# EAGLE design bt-lights-shield (EAGLE 6.1)
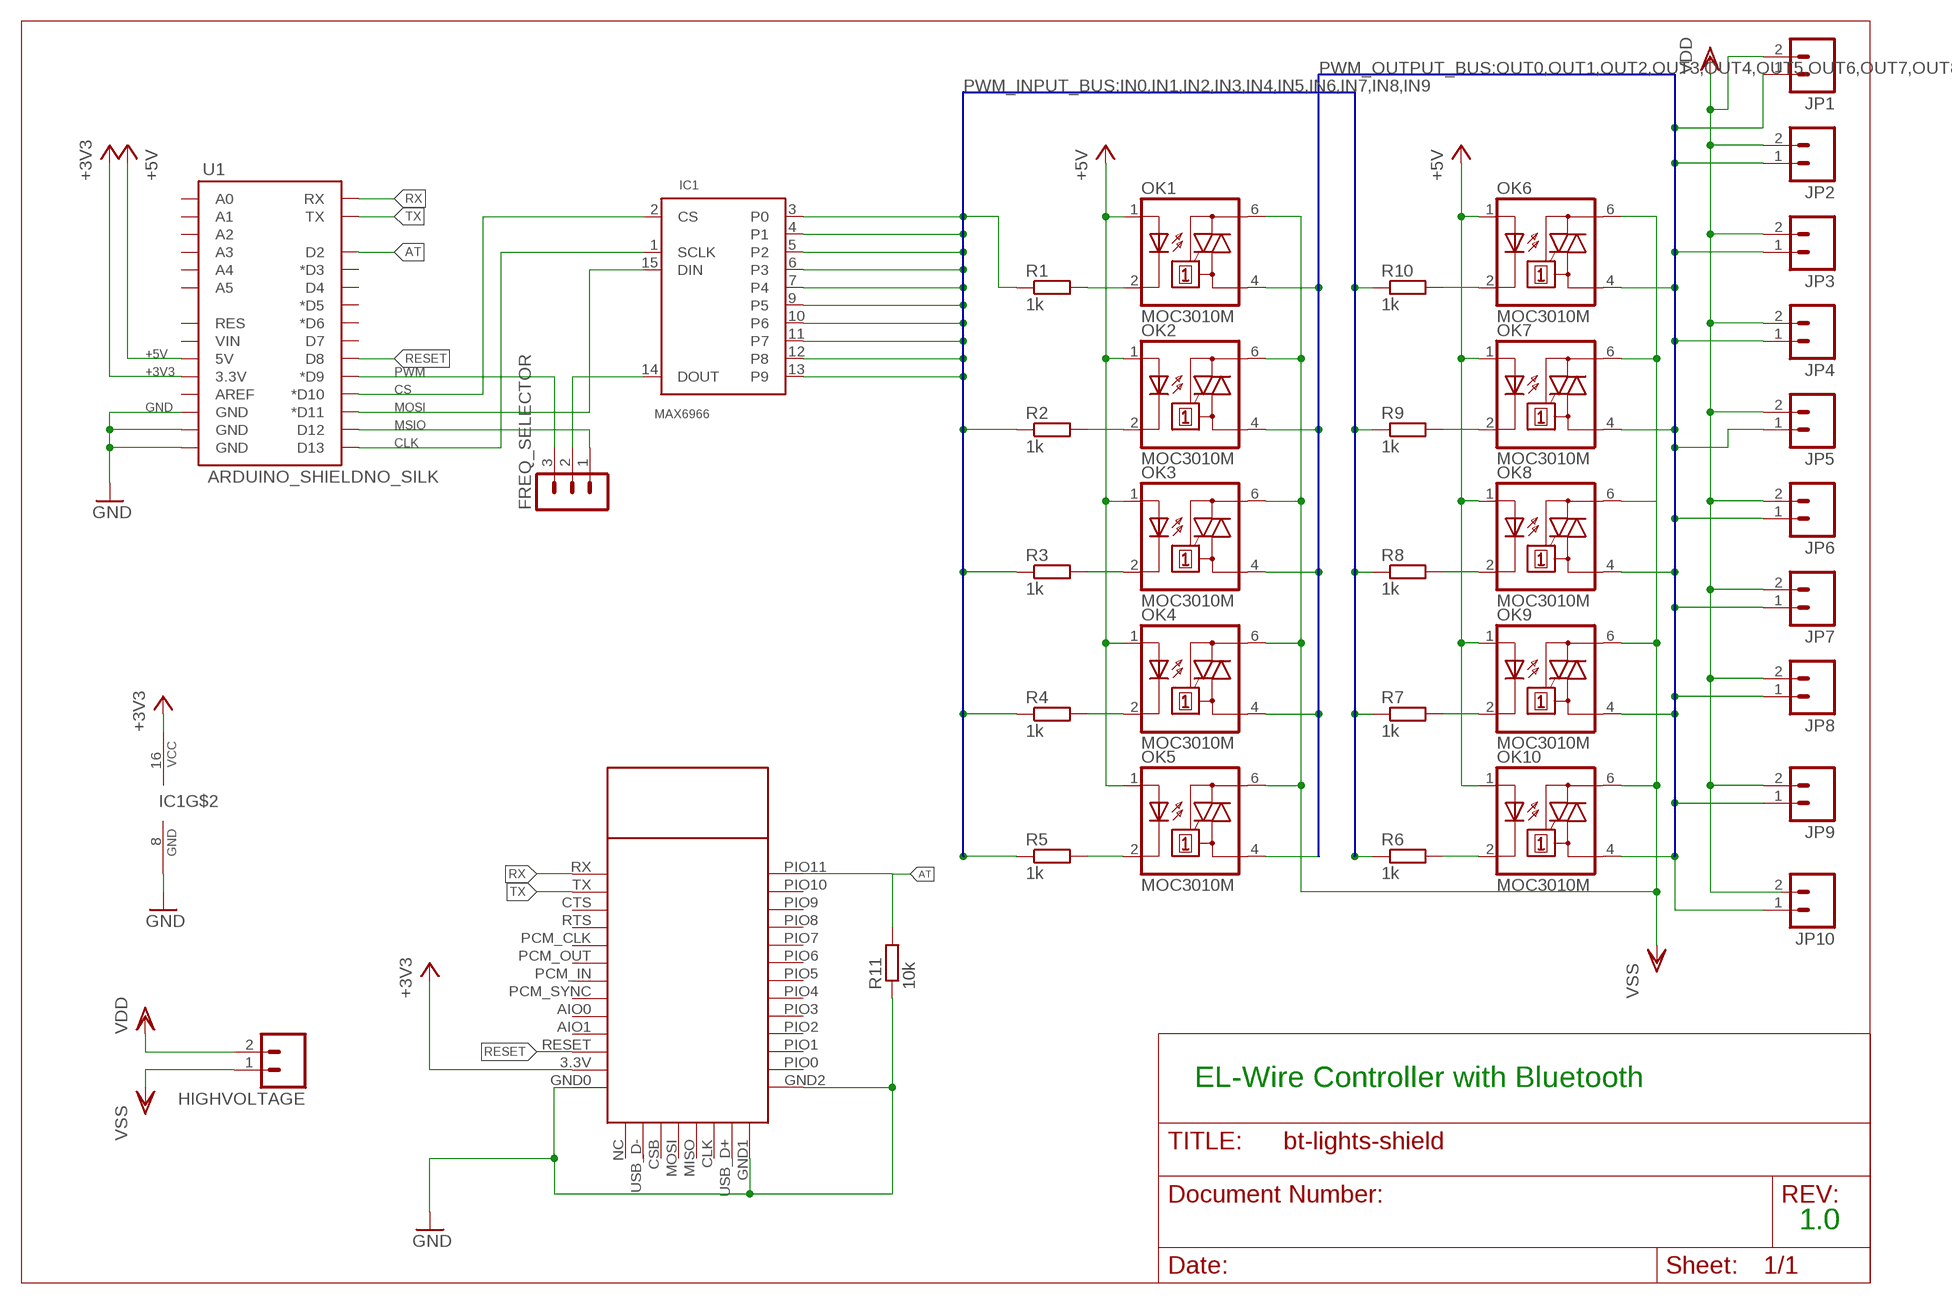
[diagram p0: schematic, sheet 1]

## Parts
FREQ_SELECTOR  MA03-1  [MA03-1]
HC0305  HC0305  [HC0305]
HIGHVOLTAGE  M02-JST-2MM-SMT  [JST-2-SMD]
IC1  MAX6966  MAX6966AEE  [QSOP16]
JP1  M02-JST-2MM-SMT  [JST-2-SMD]
JP2  M02-JST-2MM-SMT  [JST-2-SMD]
JP3  M02-JST-2MM-SMT  [JST-2-SMD]
JP4  M02-JST-2MM-SMT  [JST-2-SMD]
JP5  M02-JST-2MM-SMT  [JST-2-SMD]
JP6  M02-JST-2MM-SMT  [JST-2-SMD]
JP7  M02-JST-2MM-SMT  [JST-2-SMD]
JP8  M02-JST-2MM-SMT  [JST-2-SMD]
JP9  M02-JST-2MM-SMT  [JST-2-SMD]
JP10  M02-JST-2MM-SMT  [JST-2-SMD]
OK1  MOC3010M  [DIL06]
OK2  MOC3010M  [DIL06]
OK3  MOC3010M  [DIL06]
OK4  MOC3010M  [DIL06]
OK5  MOC3010M  [DIL06]
OK6  MOC3010M  [DIL06]
OK7  MOC3010M  [DIL06]
OK8  MOC3010M  [DIL06]
OK9  MOC3010M  [DIL06]
OK10  MOC3010M  [DIL06]
R1  1k  R-EU_R1206  [R1206]
R2  1k  R-EU_R1206  [R1206]
R3  1k  R-EU_R1206  [R1206]
R4  1k  R-EU_R1206  [R1206]
R5  1k  R-EU_R1206  [R1206]
R6  1k  R-EU_R1206  [R1206]
R7  1k  R-EU_R1206  [R1206]
R8  1k  R-EU_R1206  [R1206]
R9  1k  R-EU_R1206  [R1206]
R10  1k  R-EU_R1206  [R1206]
R11  10k  R-EU_R1206  [R1206]
U1  ARDUINO_SHIELDNO_SILK  [DUEMILANOVE_VIAS]

## Nets
+3V3: HC0305.3.3V IC1.16(VCC) U1.3.3V
+5V: OK1.1(A) OK2.1(A) OK3.1(A) OK4.1(A) OK5.1(A) OK6.1(A) OK7.1(A) OK8.1(A) OK9.1(A) OK10.1(A) U1.5V
AT: HC0305.PIO11 R11.2 U1.D2
CLK: IC1.1(SCLK) U1.D13
CS: IC1.2(CS) U1.D10(*D10)
GND: HC0305.GND0 HC0305.GND1 HC0305.GND2 IC1.8(GND) R11.1 U1.GND@0(GND) U1.GND@1(GND) U1.GND@2(GND)
IN0: IC1.3(P0) R1.1
IN1: IC1.4(P1) R2.1
IN2: IC1.5(P2) R3.1
IN3: IC1.6(P3) R4.1
IN4: IC1.7(P4) R5.1
IN5: IC1.9(P5) R10.1
IN6: IC1.10(P6) R9.1
IN7: IC1.11(P7) R8.1
IN8: IC1.12(P8) R7.1
IN9: IC1.13(P9) R6.1
MOSI: IC1.15(DIN) U1.D11(*D11)
MSIO: FREQ_SELECTOR.1 U1.D12
N$5: OK1.2(C) R1.2
N$6: OK10.2(C) R6.2
N$7: OK9.2(C) R7.2
N$8: OK8.2(C) R8.2
N$9: OK7.2(C) R9.2
N$10: OK6.2(C) R10.2
N$11: OK2.2(C) R2.2
N$12: OK3.2(C) R3.2
N$13: OK4.2(C) R4.2
N$14: OK5.2(C) R5.2
N$16: FREQ_SELECTOR.2 IC1.14(DOUT)
OUT0: JP1.1 OK1.4(A1)
OUT1: JP2.1 OK2.4(A1)
OUT2: JP3.1 OK3.4(A1)
OUT3: JP4.1 OK4.4(A1)
OUT4: JP5.1 OK5.4(A1)
OUT5: JP6.1 OK6.4(A1)
OUT6: JP7.1 OK7.4(A1)
OUT7: JP8.1 OK8.4(A1)
OUT8: JP9.1 OK9.4(A1)
OUT9: JP10.1 OK10.4(A1)
PWM: FREQ_SELECTOR.3 U1.D9(*D9)
RESET: HC0305.RESET U1.D8
RX: HC0305.RX U1.RX
TX: HC0305.TX U1.TX
VDD: HIGHVOLTAGE.2 JP1.2 JP2.2 JP3.2 JP4.2 JP5.2 JP6.2 JP7.2 JP8.2 JP9.2 JP10.2
VSS: HIGHVOLTAGE.1 OK1.6(A2) OK2.6(A2) OK3.6(A2) OK4.6(A2) OK5.6(A2) OK6.6(A2) OK7.6(A2) OK8.6(A2) OK9.6(A2) OK10.6(A2)
Unconnected: HC0305.AIO0 HC0305.AIO1 HC0305.CLK HC0305.CSB HC0305.CTS HC0305.MISO HC0305.MOSI HC0305.NC HC0305.PCM_CLK HC0305.PCM_IN HC0305.PCM_OUT HC0305.PCM_SYNC(PCM_SNYC) HC0305.PIO0 HC0305.PIO1 HC0305.PIO2 HC0305.PIO3 HC0305.PIO4 HC0305.PIO5 HC0305.PIO6 HC0305.PIO7 HC0305.PIO8 HC0305.PIO9 HC0305.PIO10 HC0305.RTS HC0305.USB_D+ HC0305.USB_D- U1.A0 U1.A1 U1.A2 U1.A3 U1.A4 U1.A5 U1.AREF U1.D3(*D3) U1.D4 U1.D5(*D5) U1.D6(*D6) U1.D7 U1.RES U1.VIN

## Buses
PWM_INPUT_BUS:IN0,IN1,IN2,IN3,IN4,IN5,IN6,IN7,IN8,IN9
PWM_OUTPUT_BUS:OUT0,OUT1,OUT2,OUT3,OUT4,OUT5,OUT6,OUT7,OUT8,OU9

## Notes on the sheet
- EL-Wire Controller with Bluetooth
- 1.0

## Library data of the parts
FREQ_SELECTOR = con-lstb:MA03-1: PIN HEADER; OC_FARNELL: unknown; OC_NEWARK: unknown
HC0305 = HC0305:HC0305
HIGHVOLTAGE JP1-JP10 = SparkFun-Connectors:M02: Header 2 Standard 2-pin 0.1" header. Use with straight break away headers (SKU : PRT-00116), right angle break away headers (PRT-00553), swiss pins (PRT-00743), machine pins (PRT-00117), and female headers (PRT-00115). Molex polarized connector foot print use with SKU : PRT-08233 with associated crimp pins and housings.; PROD_ID: CONN-08352
IC1 = max696x:MAX6966AEE
OK1-OK10 = optocoupler:MOC30*M: RANDOM-PHASE OPTOISOLATORS TRIAC DRIVER OUTPUT Source: http://www.fairchildsemi.com MOC3020-M.pdf; MF: FAIRCHILD SEMICONDUCTOR; MPN: MOC3010-M; OC_FARNELL: 1505423; OC_NEWARK: 72K8892
R1-R11 = resistor:R-EU_: RESISTOR, European symbol
U1 = SparkFun-Boards:ARDUINO_SHIELD: Arduino shield footprint

## Board
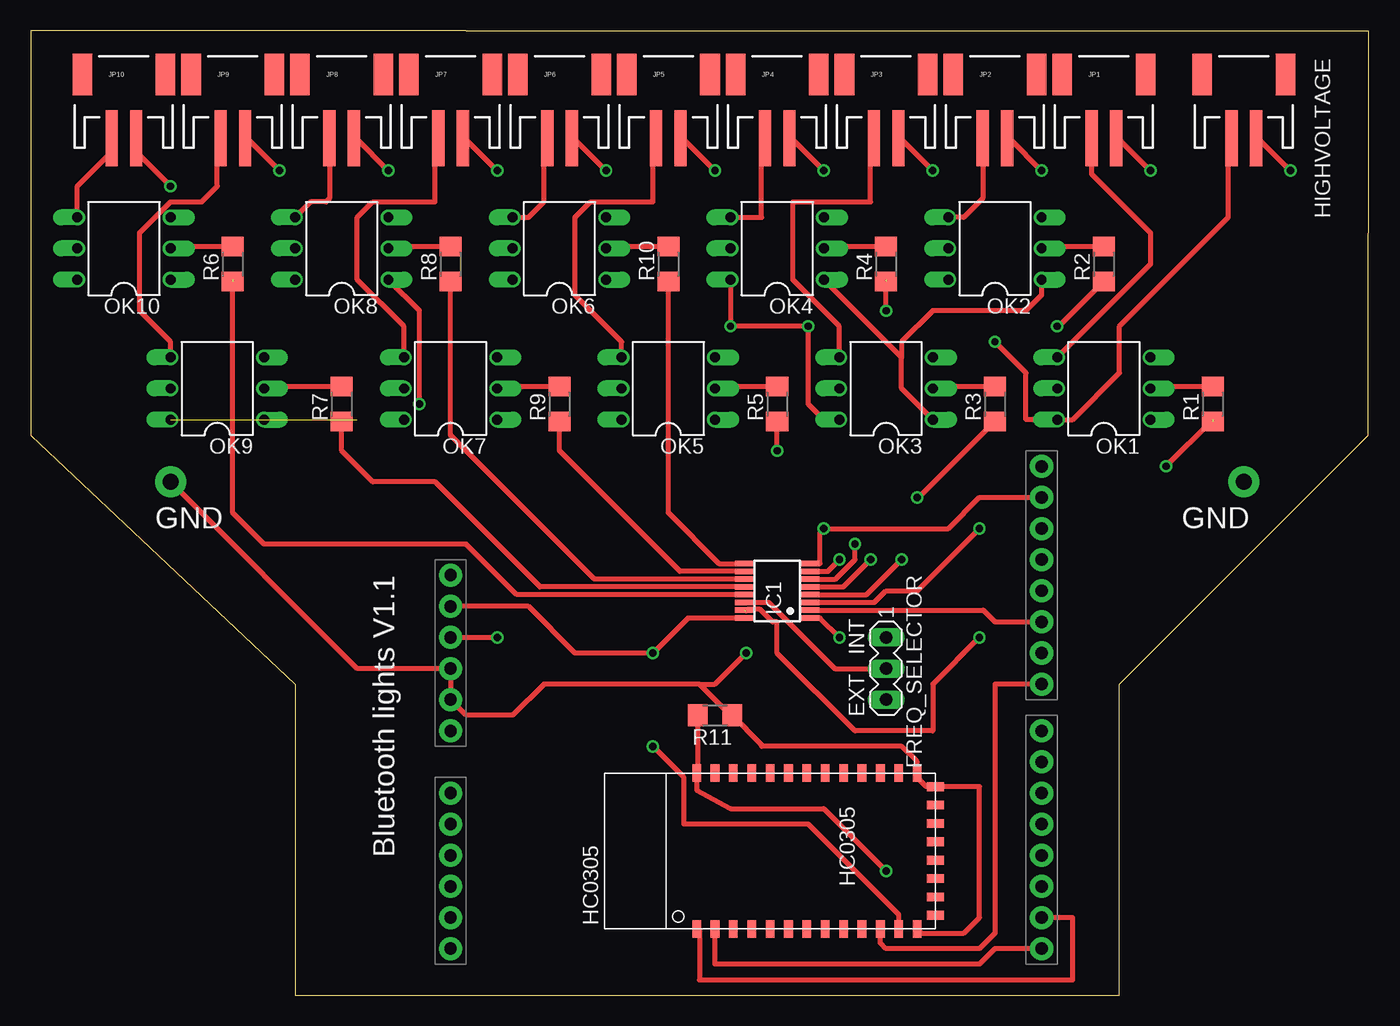
[diagram p1: board, top side]
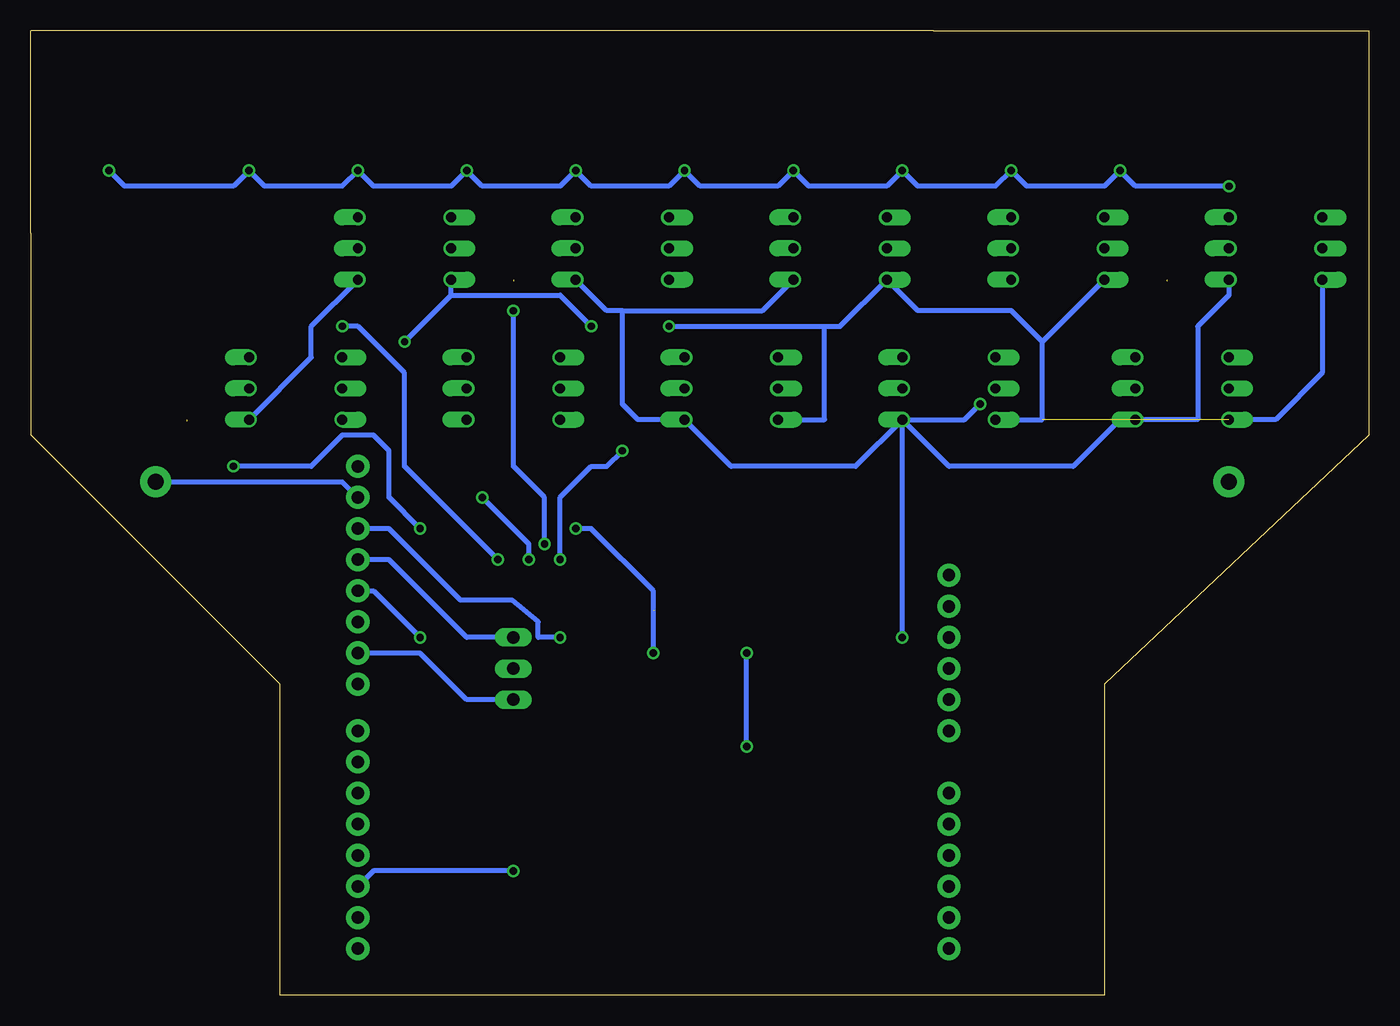
[diagram p2: board, bottom side, seen from below]

Size 109.27 x 78.74 mm. Coordinates in mm from the lower left corner, seen from the top.
Outline: 109.27,78.73 109.22,45.72 88.9,25.4 88.9,0 21.59,0 21.59,25.4 0,45.72 0,78.74 35.56,78.73
Outline: 35.56,78.74 109.22,78.74
Copper layers (1*16): Top 0.035mm / dielectric 1.5mm / Bottom 0.035mm
Design rules: minimum track width 10mil, minimum drill 24mil, track to track 8mil, track to pad 8mil, pad to pad 8mil, via to via 8mil, smd to smd 8mil, copper to edge 40mil, drill to drill 8mil, minimum pad ring 10mil, minimum via ring 8mil, stop-mask expansion 4mil, vias tented up to drill 0mil, thermal gap 10mil

### Footprints (pad centres in the part's own frame; a part is rotated, then mirrored left to right if it is on the bottom)
MA03-1 = drill 1.016 long: 1 -2.54,0; 2 0,0; 3 2.54,0
HC0305 = smd 1.422 x 0.711: 3.3V -6,-15; AIO0 -6,-10.5; AIO1 -6,-12; CTS -6,-1.5; GND0 -6,-16.5; GND2 6.7,-16.5; PCM_CLK -6,-4.5; PCM_IN -6,-7.5; PCM_OUT -6,-6; PCM_SYNC -6,-9; PIO0 6.7,-15; PIO1 6.7,-13.5; PIO2 6.7,-12; PIO3 6.7,-10.5; PIO4 6.7,-9; PIO5 6.7,-7.5; PIO6 6.7,-6; PIO7 6.7,-4.5; PIO8 6.7,-3; PIO9 6.7,-1.5; PIO10 6.7,0; PIO11 6.7,1.5; RESET -6,-13.5; RTS -6,-3; RX -6,0; TX -6,1.5 | smd 0.711 x 1.422: CLK 2.6,-18; CSB -1.9,-18; GND1 5.6,-18; MISO 1.1,-18; MOSI -0.4,-18; NC -4.9,-18; USB_D+ 4.1,-18; USB_D- -3.4,-18
JST-2-SMD = smd 1 x 4.6: 1 -1,-3.7; 2 1,-3.7 | smd 1.6 x 3.4: NC1 -3.4,1.5; NC2 3.4,1.5
QSOP16 = smd 0.45 x 1.5: 1 -2.223,-2.69; 2 -1.587,-2.69; 3 -0.953,-2.69; 4 -0.318,-2.69; 5 0.318,-2.69; 6 0.953,-2.69; 7 1.587,-2.69; 8 2.223,-2.69; 9 2.223,2.69; 10 1.587,2.69; 11 0.953,2.69; 12 0.318,2.69; 13 -0.318,2.69; 14 -0.953,2.69; 15 -1.587,2.69; 16 -2.223,2.69
DIL06 = drill 0.813 offset: 1 -2.54,-3.81; 2 0,-3.81; 3 2.54,-3.81; 4 2.54,3.81; 5 0,3.81; 6 -2.54,3.81
R1206 = smd 1.6 x 1.803: 1 -1.422,0; 2 1.422,0
DUEMILANOVE_VIAS = drill 1.016 pad 1.88: 3.3V 50.8,13.97; 5V 50.8,16.51; A0 50.8,29.21; A1 50.8,31.75; A2 50.8,34.29; A3 50.8,36.83; A4 50.8,39.37; A5 50.8,41.91; AREF 2.54,2.54; D2 2.54,36.83; D3 2.54,34.29; D4 2.54,31.75; D5 2.54,29.21; D6 2.54,26.67; D7 2.54,24.13; D8 2.54,20.32; D9 2.54,17.78; D10 2.54,15.24; D11 2.54,12.7; D12 2.54,10.16; D13 2.54,7.62; GND@0 50.8,19.05; GND@1 50.8,21.59; GND@2 2.54,5.08; RES 50.8,11.43; RX 2.54,41.91; TX 2.54,39.37; VIN 50.8,24.13

### Placement (x,y rotation side)
FREQ_SELECTOR  69.85,26.67 270 top
HC0305  55.88,11.43 90 top
HIGHVOLTAGE  99.06,73.66 0 top
IC1  60.96,33.02 90 top
JP1  87.63,73.66 0 top
JP2  78.74,73.66 0 top
JP3  69.85,73.66 0 top
JP4  60.96,73.66 0 top
JP5  52.07,73.66 0 top
JP6  43.18,73.66 0 top
JP7  34.29,73.66 0 top
JP8  25.4,73.66 0 top
JP9  16.51,73.66 0 top
JP10  7.62,73.66 0 top
OK1  87.63,49.53 90 top
OK2  78.74,60.96 90 top
OK3  69.85,49.53 90 top
OK4  60.96,60.96 90 top
OK5  52.07,49.53 90 top
OK6  43.18,60.96 90 top
OK7  34.29,49.53 90 top
OK8  25.4,60.96 90 top
OK9  15.24,49.53 90 top
OK10  7.62,60.96 90 top
R1  96.52,48.26 90 top
R2  87.63,59.69 90 top
R3  78.74,48.26 90 top
R4  69.85,59.69 90 top
R5  60.96,48.26 90 top
R6  16.51,59.69 90 top
R7  25.4,48.26 90 top
R8  34.29,59.69 90 top
R9  43.18,48.26 90 top
R10  52.07,59.69 90 top
R11  55.88,22.86 180 top
U1  85.09,45.72 180 top

### Tracks (layer width: path | path; a pad name or v marks a point on that pad's centre or on a via)
+3V3  (via drill 0.6)
  Top 0.406: v50.8,20.32 53.34,17.78 53.34,13.97 63.5,13.97 70.88,6.59 HC0305.3.3V | U1.3.3V 40.64,31.75 44.45,27.94 v50.8,27.94 53.66,30.8 IC1.16
  Bottom 0.406: v50.8,20.32 v50.8,27.94
+5V  (via drill 0.6)
  Top 0.406: U1.5V v38.1,29.21 | OK2.1 82.55,57.15 81.28,55.88 73.66,55.88 71.12,53.34 71.12,52.07 | OK3.1 71.12,49.53 71.12,52.07 | 71.12,52.07 OK4.1 | v31.75,48.26 31.75,55.88 OK8.1
  Bottom 0.406: v38.1,29.21 OK7.1 | OK10.1 11.43,57.15 13.97,54.61 13.97,46.99 OK9.1 20.32,46.99 24.13,43.18 34.29,43.18 OK7.1 | OK7.1 41.91,43.18 52.07,43.18 OK5.1 59.69,46.99 60.96,48.26 60.96,55.88 | 60.96,55.88 62.23,55.88 OK4.1 | OK2.1 86.36,54.61 86.36,52.07 OK1.1 | 60.96,55.88 49.53,55.88 OK6.1 | OK7.1 33.02,46.99 v31.75,48.26
AT  (via drill 0.6)
  Top 0.406: R11.2 54.46,18.21 HC0305.PIO11 54.38,16.74 57.15,15.24 64.77,15.24 v69.85,10.16
  Bottom 0.406: v69.85,10.16 81.28,10.16 U1.D2
CLK  (via drill 0.6)
  Top 0.406: IC1.1 64.45,30.8 v66.04,29.21
  Bottom 0.406: v66.04,29.21 67.82,29.21 67.82,30.48 69.98,32.26 74.17,32.26 80.01,38.1 U1.D13
CS
  Top 0.406: IC1.2 77.79,31.43 78.74,30.48 U1.D10
GND  (via drill 0.6, 1.3 pad 2.54)
  Top 0.406: HC0305.GND0 72.73,5.08 76.2,5.08 77.47,6.35 77.47,17.03 HC0305.GND1 73.14,17.03 72.38,17.79 HC0305.GND2 72.38,19.04 72.39,19.05 71.12,20.32 59.69,20.32 59.69,20.47 R11.1 57.15,22.86 54.61,25.4 | IC1.8 64.45,35.24 64.45,37.78 v64.77,38.1 74.93,38.1 77.47,40.64 U1.GND@2 | 54.61,25.4 41.91,25.4 39.37,22.86 35.56,22.86 U1.GND@1 U1.GND@0 26.67,26.67 v11.43,41.91 | 54.61,25.4 55.88,25.4 v58.42,27.94
  Bottom 0.406: v99.06,41.91 83.82,41.91 U1.GND@2 | v58.42,27.94 58.42,33.02 63.5,38.1 v64.77,38.1
IN0  (via drill 0.6)  (1 unrouted)
  Top 0.406: IC1.3 68.9,32.07 69.85,33.02 72.39,33.02 v77.47,38.1 | v92.71,43.18 96.52,46.99
  Bottom 0.406: v77.47,38.1 80.01,40.64 80.01,44.45 81.28,45.72 83.82,45.72 86.36,43.18 v92.71,43.18
IN1  (via drill 0.6)
  Top 0.406: v71.12,35.56 68.26,32.7 IC1.4 | v83.82,54.61 83.97,54.61 R2.1
  Bottom 0.406: v71.12,35.56 78.74,43.18 78.74,50.8 82.55,54.61 v83.82,54.61
IN2  (via drill 0.6)
  Top 0.406: v68.58,35.56 66.36,33.34 IC1.5 | v72.39,40.64 72.54,40.64 R3.1
  Bottom 0.406: v68.58,35.56 68.58,36.83 v72.39,40.64
IN3  (via drill 0.6)  (1 unrouted)
  Top 0.406: IC1.6 65.72,33.97 67.31,35.56 v67.31,36.83 | v69.85,55.88 69.85,58.42
  Bottom 0.406: v67.31,36.83 67.31,40.64 69.85,43.18 v69.85,55.88
IN4  (via drill 0.6)
  Top 0.406: v66.04,35.56 65.09,34.61 IC1.7 | v60.96,44.45 R5.1
  Bottom 0.406: v66.04,35.56 66.04,40.64 63.5,43.18 62.23,43.18 v60.96,44.45
IN5
  Top 0.406: R10.1 52.07,39.37 56.2,35.24 IC1.9
IN6
  Top 0.406: R9.1 43.18,44.45 53.02,34.61 IC1.10
IN7
  Top 0.406: R8.1 34.29,45.72 45.72,34.29 46.04,33.97 IC1.11
IN8
  Top 0.406: R7.1 25.4,44.45 27.94,41.91 33.02,41.91 40.64,34.29 41.59,33.34 IC1.12
IN9  (1 unrouted)
  Top 0.406: IC1.13 39.69,32.7 35.56,36.83 19.05,36.83 16.51,39.37 16.51,58.42
MOSI  (via drill 0.6)  (1 unrouted)
  Top 0.406: v77.47,29.21 73.66,25.4 73.66,21.59 67.31,21.59 60.96,27.94 60.96,30.48 60.58,30.48 59.56,31.5 58.55,31.5 58.42,31.37
  Bottom 0.406: U1.D11 81.28,33.02 v77.47,29.21
MSIO
  Bottom 0.406: FREQ_SELECTOR.1 73.66,29.21 80.01,35.56 U1.D12
N$5
  Top 0.406: R1.2 91.59,49.68 OK1.2
N$6
  Top 0.406: R6.2 11.58,61.11 OK10.2
N$7
  Top 0.406: R7.2 19.2,49.68 OK9.2
N$8
  Top 0.406: R8.2 29.36,61.11 OK8.2
N$9
  Top 0.406: R9.2 38.25,49.68 OK7.2
N$10
  Top 0.406: R10.2 47.14,61.11 OK6.2
N$11
  Top 0.406: R2.2 82.7,61.11 OK2.2
N$12
  Top 0.406: R3.2 73.81,49.68 OK3.2
N$13
  Top 0.406: R4.2 64.92,61.11 OK4.2
N$14
  Top 0.406: R5.2 56.03,49.68 OK5.2
N$16
  Top 0.406: IC1.14 60.26,32.07 65.66,26.67 FREQ_SELECTOR.2
OUT0
  Top 0.406: JP1.1 86.63,67.04 91.44,62.23 91.44,59.69 OK1.4
OUT1
  Top 0.406: JP2.1 77.74,65.04 76.2,63.5 OK2.4
OUT2
  Top 0.406: OK3.4 66.04,54.61 62.23,58.42 62.23,64.77 68.58,64.77 68.58,69.85 68.69,69.96 JP3.1
OUT3
  Top 0.406: OK4.4 59.69,63.5 59.69,69.69 JP4.1
OUT4
  Top 0.406: OK5.4 48.26,53.34 44.45,57.15 44.45,63.5 45.72,64.77 50.8,64.77 50.8,69.69 JP5.1
OUT5
  Top 0.406: OK6.4 40.64,63.5 41.91,64.77 41.91,69.69 JP6.1
OUT6
  Top 0.406: OK7.4 30.48,54.61 26.67,58.42 26.67,63.5 27.94,64.77 33.02,64.77 33.02,69.85 33.13,69.96 JP7.1
OUT7
  Top 0.406: JP8.1 24.4,65.04 24.13,64.77 22.86,64.77 OK8.4
OUT8
  Top 0.406: OK9.4 11.43,53.34 8.89,55.88 8.89,62.23 11.43,64.77 13.97,64.77 15.24,66.04 15.24,69.85 15.35,69.96 JP9.1
OUT9
  Top 0.406: OK10.4 3.81,66.04 6.35,68.58 6.35,69.69 JP10.1
PWM
  Bottom 0.406: FREQ_SELECTOR.3 73.66,24.13 77.47,27.94 U1.D9
RESET
  Top 0.406: U1.D8 78.74,25.4 78.74,5.08 77.47,3.81 69.85,3.81 69.38,4.28 HC0305.RESET
RX
  Top 0.406: U1.RX 78.74,3.81 77.47,2.54 55.88,2.54 HC0305.RX
TX
  Top 0.406: HC0305.TX 54.61,5.43 54.61,1.27 85.09,1.27 85.09,6.35 U1.TX
VDD  (via drill 0.6)
  Top 0.406: JP10.2 8.62,68.85 v11.43,66.04 | v102.87,67.31 100.22,69.96 HIGHVOLTAGE.2 | JP9.2 17.67,69.96 v20.32,67.31 | JP8.2 26.56,69.96 v29.21,67.31 | JP7.2 35.45,69.96 v38.1,67.31 | JP6.2 44.34,69.96 v46.99,67.31 | JP5.2 53.23,69.96 v55.88,67.31 | JP4.2 62.12,69.96 v64.77,67.31 | JP3.2 71.01,69.96 v73.66,67.31 | JP2.2 79.9,69.96 v82.55,67.31 | JP1.2 88.79,69.96 v91.44,67.31
  Bottom 0.406: v11.43,66.04 19.05,66.04 v20.32,67.31 21.59,66.04 27.94,66.04 v29.21,67.31 30.48,66.04 36.83,66.04 v38.1,67.31 39.37,66.04 45.72,66.04 v46.99,67.31 48.26,66.04 54.61,66.04 v55.88,67.31 57.15,66.04 63.5,66.04 v64.77,67.31 66.04,66.04 72.39,66.04 v73.66,67.31 74.93,66.04 81.28,66.04 v82.55,67.31 83.82,66.04 90.17,66.04 v91.44,67.31 92.71,66.04 101.6,66.04 v102.87,67.31
VSS  (via drill 0.6)  (1 unrouted)
  Top 0.406: OK3.6 64.77,46.99 63.5,48.26 v63.5,54.61 v57.15,54.61 OK4.6 | v78.74,53.34 81.28,50.8 81.28,46.99 OK1.6 85.09,46.99 88.9,50.8 88.9,54.61 97.79,63.5 97.79,69.85 97.9,69.96 HIGHVOLTAGE.1
  Bottom 0.406: OK10.6 3.81,50.8 7.62,46.99 OK9.6 | OK7.6 26.67,46.99 26.67,53.34 | 26.67,53.34 OK8.6 | OK5.6 44.45,46.99 44.45,54.61 | 44.45,54.61 43.18,54.61 OK6.6 36.83,55.88 29.21,55.88 26.67,53.34 | v78.74,53.34 74.93,57.15 | 74.93,57.15 OK2.6 | v57.15,54.61 44.45,54.61 | 74.93,57.15 66.04,57.15 v63.5,54.61

### Text on the board
tNames: GND | GND | Bluetooth lights V1.1 | INT | EXT